# EAGLE schematic SideShield (EAGLE 5.11)
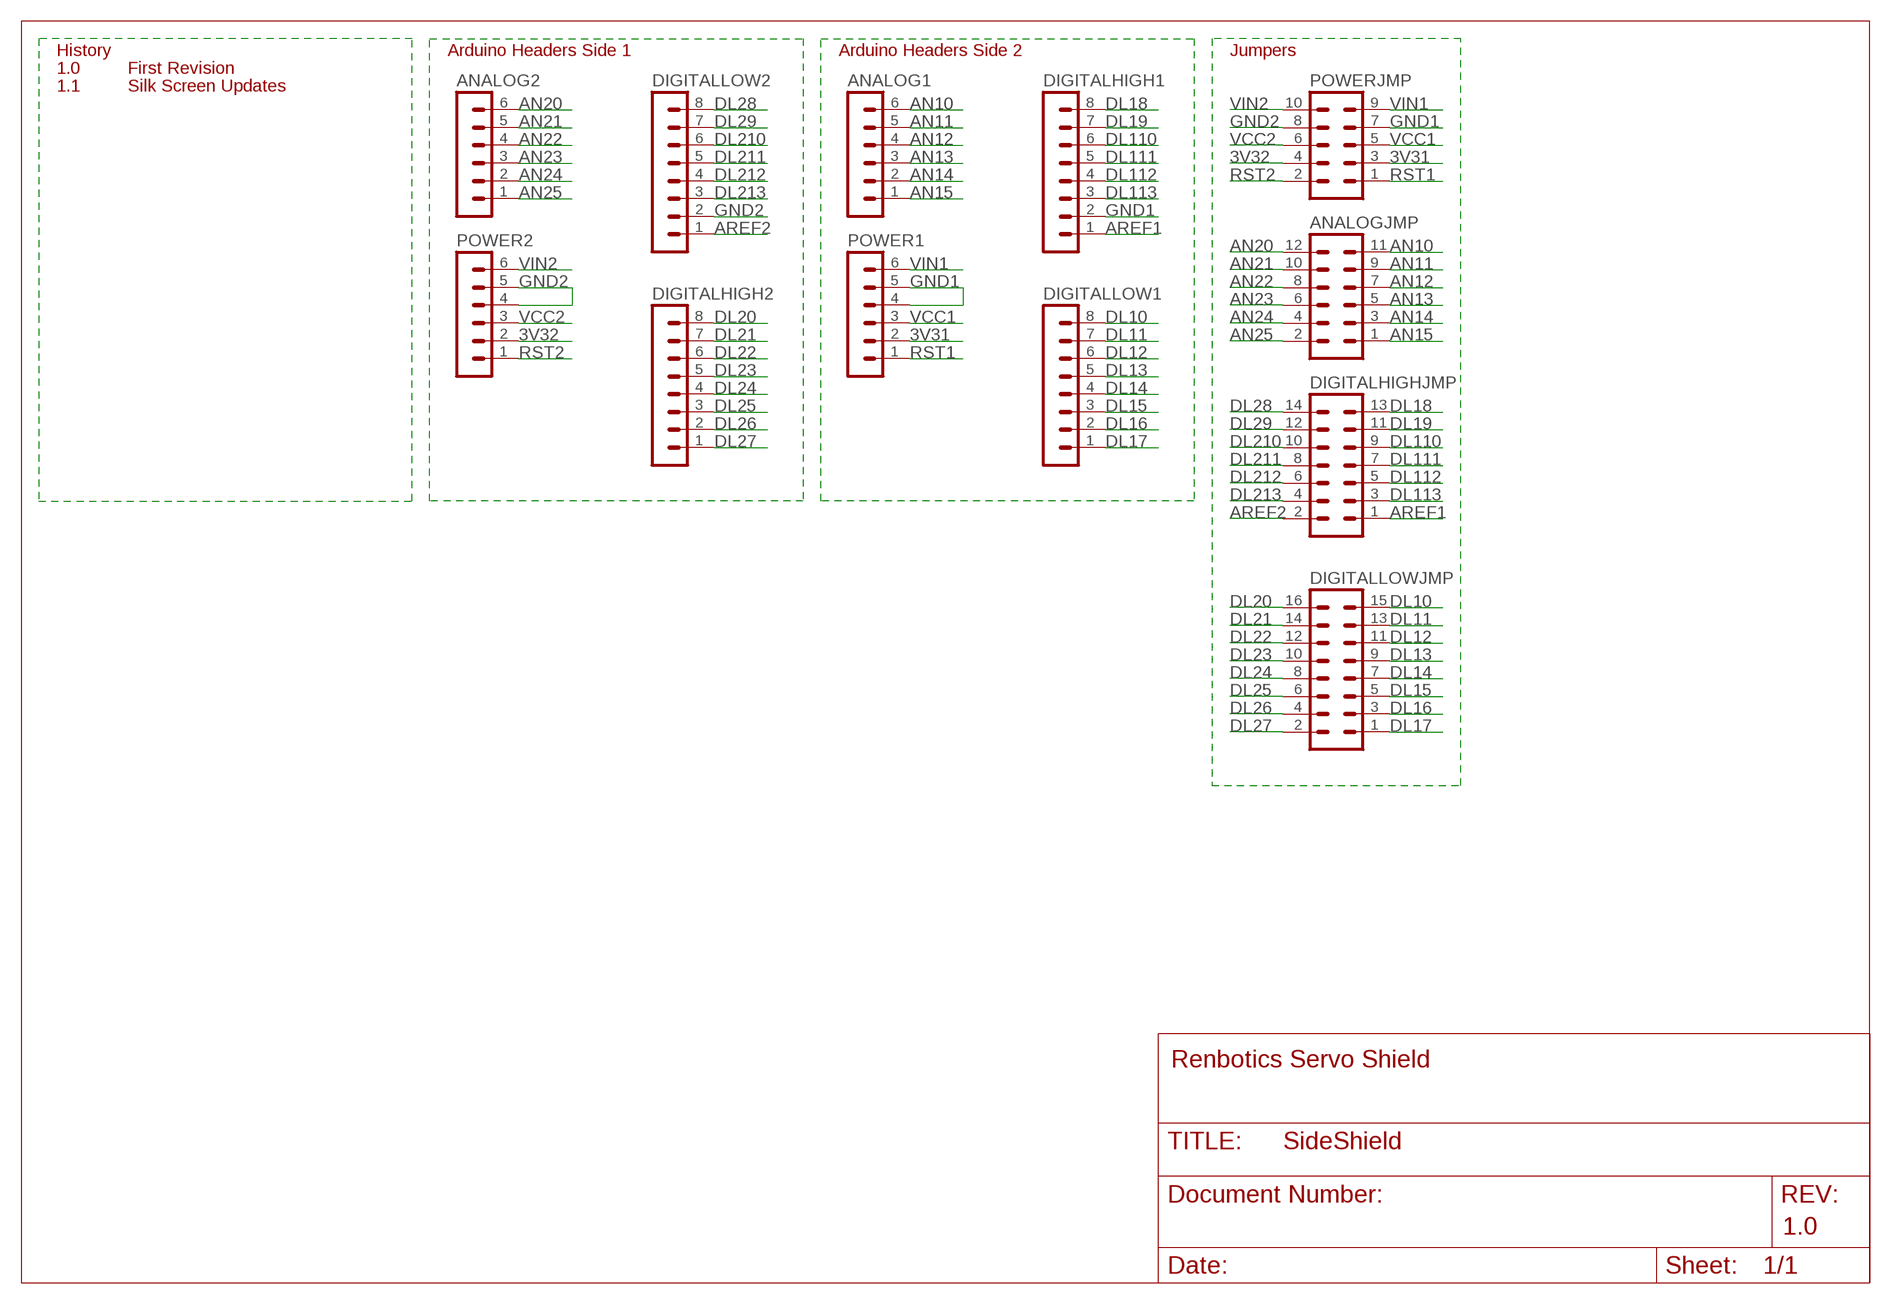
[diagram p0: schematic, sheet 1]

## Parts
ANALOG1  MA06-1  [MA06-1]
ANALOG2  MA06-1  [MA06-1]
ANALOGJMP  MA06-2  [MA06-2]
DIGITALHIGH1  MA08-1  [MA08-1]
DIGITALHIGH2  MA08-1  [MA08-1]
DIGITALHIGHJMP  MA07-2  [MA07-2]
DIGITALLOW1  MA08-1  [MA08-1]
DIGITALLOW2  MA08-1  [MA08-1]
DIGITALLOWJMP  MA08-2  [MA08-2]
POWER1  MA06-1  [MA06-1]
POWER2  MA06-1  [MA06-1]
POWERJMP  MA05-2  [MA05-2]

## Nets
3V31: POWER1.2 POWERJMP.3
3V32: POWER2.2 POWERJMP.4
AN10: ANALOG1.6 ANALOGJMP.11
AN11: ANALOG1.5 ANALOGJMP.9
AN12: ANALOG1.4 ANALOGJMP.7
AN13: ANALOG1.3 ANALOGJMP.5
AN14: ANALOG1.2 ANALOGJMP.3
AN15: ANALOG1.1 ANALOGJMP.1
AN20: ANALOG2.6 ANALOGJMP.12
AN21: ANALOG2.5 ANALOGJMP.10
AN22: ANALOG2.4 ANALOGJMP.8
AN23: ANALOG2.3 ANALOGJMP.6
AN24: ANALOG2.2 ANALOGJMP.4
AN25: ANALOG2.1 ANALOGJMP.2
AREF1: DIGITALHIGH1.1 DIGITALHIGHJMP.1
AREF2: DIGITALHIGHJMP.2 DIGITALLOW2.1
DL10: DIGITALLOW1.8 DIGITALLOWJMP.15
DL11: DIGITALLOW1.7 DIGITALLOWJMP.13
DL12: DIGITALLOW1.6 DIGITALLOWJMP.11
DL13: DIGITALLOW1.5 DIGITALLOWJMP.9
DL14: DIGITALLOW1.4 DIGITALLOWJMP.7
DL15: DIGITALLOW1.3 DIGITALLOWJMP.5
DL16: DIGITALLOW1.2 DIGITALLOWJMP.3
DL17: DIGITALLOW1.1 DIGITALLOWJMP.1
DL18: DIGITALHIGH1.8 DIGITALHIGHJMP.13
DL19: DIGITALHIGH1.7 DIGITALHIGHJMP.11
DL20: DIGITALHIGH2.8 DIGITALLOWJMP.16
DL21: DIGITALHIGH2.7 DIGITALLOWJMP.14
DL22: DIGITALHIGH2.6 DIGITALLOWJMP.12
DL23: DIGITALHIGH2.5 DIGITALLOWJMP.10
DL24: DIGITALHIGH2.4 DIGITALLOWJMP.8
DL25: DIGITALHIGH2.3 DIGITALLOWJMP.6
DL26: DIGITALHIGH2.2 DIGITALLOWJMP.4
DL27: DIGITALHIGH2.1 DIGITALLOWJMP.2
DL28: DIGITALHIGHJMP.14 DIGITALLOW2.8
DL29: DIGITALHIGHJMP.12 DIGITALLOW2.7
DL110: DIGITALHIGH1.6 DIGITALHIGHJMP.9
DL111: DIGITALHIGH1.5 DIGITALHIGHJMP.7
DL112: DIGITALHIGH1.4 DIGITALHIGHJMP.5
DL113: DIGITALHIGH1.3 DIGITALHIGHJMP.3
DL210: DIGITALHIGHJMP.10 DIGITALLOW2.6
DL211: DIGITALHIGHJMP.8 DIGITALLOW2.5
DL212: DIGITALHIGHJMP.6 DIGITALLOW2.4
DL213: DIGITALHIGHJMP.4 DIGITALLOW2.3
GND1: DIGITALHIGH1.2 POWER1.4 POWER1.5 POWERJMP.7
GND2: DIGITALLOW2.2 POWER2.4 POWER2.5 POWERJMP.8
RST1: POWER1.1 POWERJMP.1
RST2: POWER2.1 POWERJMP.2
VCC1: POWER1.3 POWERJMP.5
VCC2: POWER2.3 POWERJMP.6
VIN1: POWER1.6 POWERJMP.9
VIN2: POWER2.6 POWERJMP.10

## Notes on the sheet
- History | Arduino Headers Side 1 | Arduino Headers Side 2 | Jumpers
- 1.0 | First Revision
- 1.1 | Silk Screen Updates
- Renbotics Servo Shield
- 1.0

## Library data of the parts
ANALOG1 ANALOG2 POWER1 POWER2 = con-lstb:MA06-1: PIN HEADER
ANALOGJMP = con-lstb:MA06-2: PIN HEADER
DIGITALHIGH1 DIGITALHIGH2 DIGITALLOW1 DIGITALLOW2 = con-lstb:MA08-1: PIN HEADER
DIGITALHIGHJMP = con-lstb:MA07-2: PIN HEADER
DIGITALLOWJMP = con-lstb:MA08-2: PIN HEADER
POWERJMP = con-lstb:MA05-2: PIN HEADER

## Net classes
0 default: width 0.254 mm, drill 0.305 mm, clearance 0.152 mm
1 power: width 0.61 mm, drill 0.508 mm, clearance 0.152 mm